# Altium project GBA.PrjPcb (part 3 of 4)

## Sheet [03] - MCU.SchDoc
size A3; DocumentNumber: 5; SheetNumber: 4; SheetTotal: 9
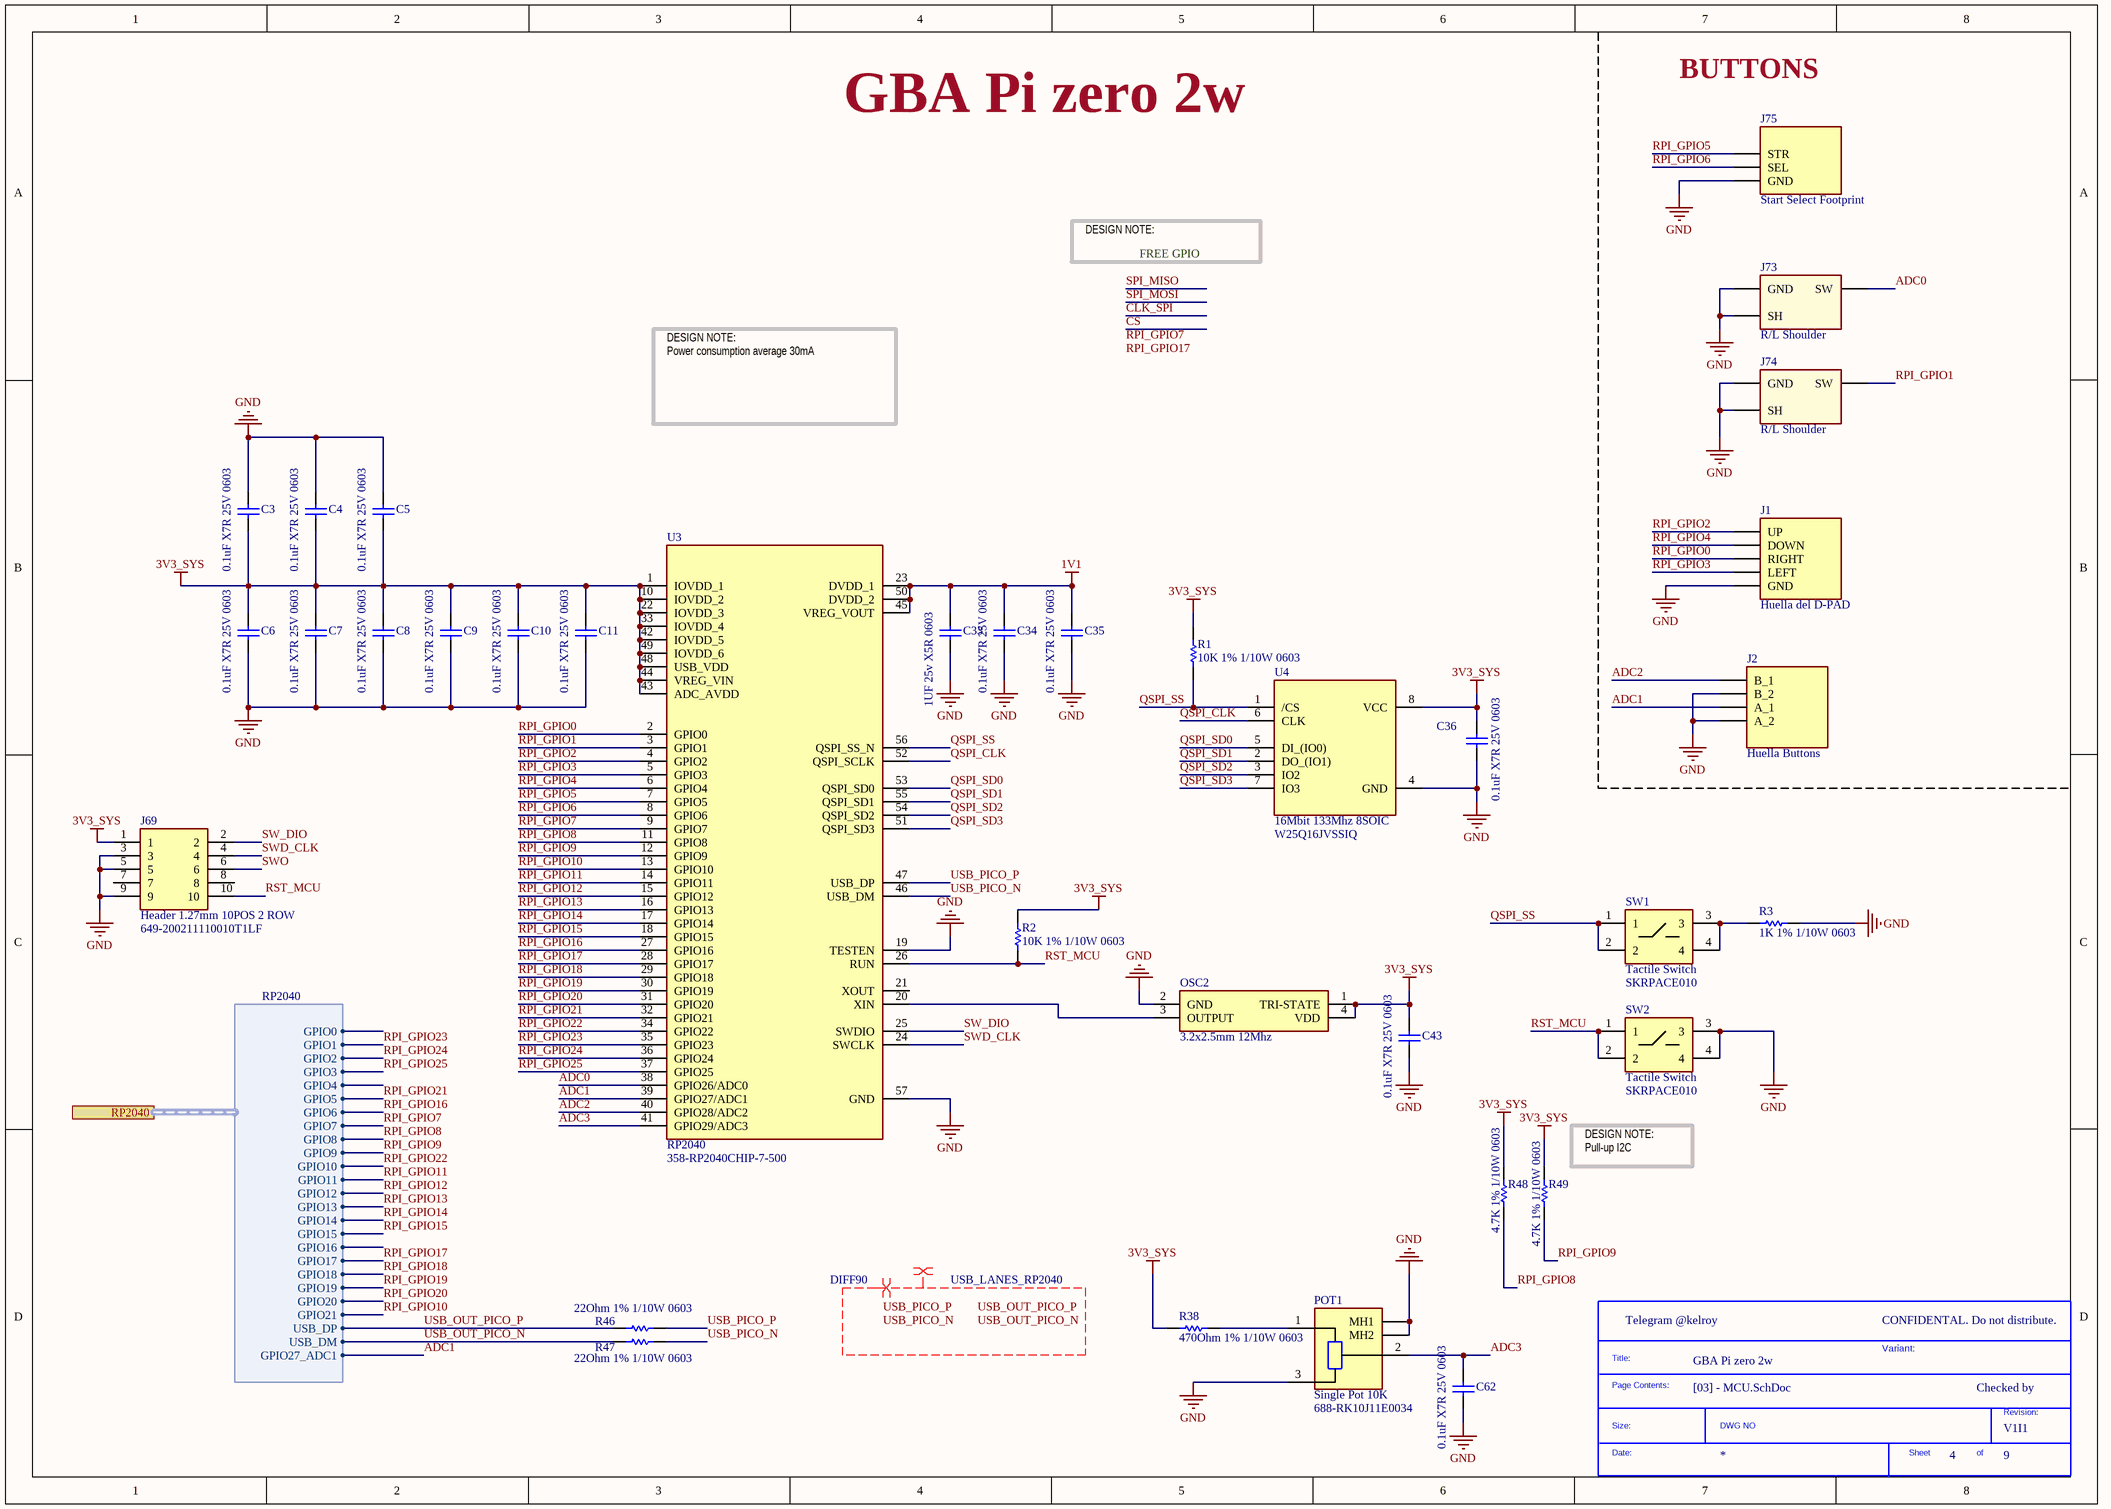
[diagram p7: [03] - MCU.SchDoc]

### Parts
(Parts that share a designator on the sheet are numbered #1, #2 ... from top to bottom, then left to right.)
*#8  SDTitleBlock  (value not drawn)  (graphical)
C3  0.1uF X7R 25V 0603  [C 0603/1608]
C4  0.1uF X7R 25V 0603  [C 0603/1608]
C5  0.1uF X7R 25V 0603  [C 0603/1608]
C6  0.1uF X7R 25V 0603  [C 0603/1608]
C7  0.1uF X7R 25V 0603  [C 0603/1608]
C8  0.1uF X7R 25V 0603  [C 0603/1608]
C9  0.1uF X7R 25V 0603  [C 0603/1608]
C10  0.1uF X7R 25V 0603  [C 0603/1608]
C11  0.1uF X7R 25V 0603  [C 0603/1608]
C33  1UF 25v X5R 0603  [C 0603/1608]
C34  0.1uF X7R 25V 0603  [C 0603/1608]
C35  0.1uF X7R 25V 0603  [C 0603/1608]
C36  0.1uF X7R 25V 0603  [C 0603/1608]
C43  0.1uF X7R 25V 0603  [C 0603/1608]
C62  0.1uF X7R 25V 0603  [C 0603/1608]
J1  Huella del D-PAD  [D-PAD]  (no BOM)
J2  Huella Buttons  [AB_BUTTON]  (no BOM)
J69  Header 1.27mm 10POS 2 ROW  Supplier Part Number 1: 649-200211110010T1LF  [20021111-00010T1LF]
J73  R/L Shoulder  [SHOULDER_BUTTON]
J74  R/L Shoulder  [SHOULDER_BUTTON]
J75  Start Select Footprint  [START SELECT FOOTPRINT]
OSC2  3.2x2.5mm 12Mhz  [ECS3225MV120BNTR]
POT1  Single Pot 10K  Supplier Part Number 1: 688-RK10J11E0034  [RK10J11E0034]
R1  10K 1% 1/10W 0603  [R 0603/1608]
R2  10K 1% 1/10W 0603  [R 0603/1608]
R3  1K 1% 1/10W 0603  [R 0603/1608]
R38  470Ohm 1% 1/10W 0603  [R 0603/1608]
R46  22Ohm 1% 1/10W 0603  [R 0603/1608]
R47  22Ohm 1% 1/10W 0603  [R 0603/1608]
R48  4.7K 1% 1/10W 0603  [R 0603/1608]
R49  4.7K 1% 1/10W 0603  [R 0603/1608]
SW1  Tactile Switch  [SKRPACE010]
SW2  Tactile Switch  [SKRPACE010]
U3  RP2040  Supplier Part Number 1: 358-RP2040CHIP-7-500  [QFN40P700X700X90-57N-D]
U4  16Mbit 133Mhz 8SOIC  [SOIC127P790X216-8N]

### Ports
RP2040 (harness RP2040)

### Harnesses
RP2040: GPIO0, GPIO1, GPIO2, GPIO3, USB_DP, USB_DM, GPIO27_ADC1, GPIO4, GPIO5, GPIO6, GPIO7, GPIO8, GPIO9, GPIO10, GPIO11, GPIO12, GPIO13, GPIO14, GPIO15, GPIO16, GPIO17, GPIO18, GPIO19, GPIO20, GPIO21

### Nets
1V1: C33.1 C34.1 C35.1 U3.23(DVDD_1) U3.45(VREG_VOUT) U3.50(DVDD_2)
3V3_SYS: C3.2 C4.2 C5.2 C6.1 C7.1 C8.1 C9.1 C10.1 C11.1 C36.1 C43.1 J69.1 OSC2.1(TRI-STATE) OSC2.4(VDD) R1.2 R2.2 R38.1 R48.2 R49.2 U3.1(IOVDD_1) U3.10(IOVDD_2) U3.22(IOVDD_3) U3.33(IOVDD_4) U3.42(IOVDD_5) U3.43(ADC_AVDD) U3.44(VREG_VIN) U3.48(USB_VDD) U3.49(IOVDD_6) U4.8(VCC)
GND: C3.1 C4.1 C5.1 C6.2 C7.2 C8.2 C9.2 C10.2 C11.2 C33.2 C34.2 C35.2 C36.2 C43.2 C62.2 J1.GND J2.A_2 J2.B_2 J69.3 J69.5 J69.9 J73.GND J73.SH J74.GND J74.SH J75.GND OSC2.2(GND) POT1.3 POT1.MH1 POT1.MH2 R3.1 SW2.3 SW2.4 U3.19(TESTEN) U3.57(GND) U4.4(GND)  [project net CSN]
ADC0: J73.SW U3.38(GPIO26/ADC0)
ADC1: J2.A_1 U3.39(GPIO27/ADC1) ; port RP2040.GPIO27_ADC1
ADC2: J2.B_1 U3.40(GPIO28/ADC2)
ADC3: C62.1 POT1.2 U3.41(GPIO29/ADC3)
QSPI_CLK: U3.52(QSPI_SCLK) U4.6(CLK)
QSPI_SD0: U3.53(QSPI_SD0) U4.5(DI_(IO0))
QSPI_SD1: U3.55(QSPI_SD1) U4.2(DO_(IO1))
QSPI_SD2: U3.54(QSPI_SD2) U4.3(IO2)
QSPI_SD3: U3.51(QSPI_SD3) U4.7(IO3)
QSPI_SS: R1.1 SW1.1 SW1.2 U3.56(QSPI_SS_N) U4.1(/CS)
RPI_GPIO0: J1.RIGHT U3.2(GPIO0)
RPI_GPIO1: J74.SW U3.3(GPIO1)
RPI_GPIO2: J1.UP U3.4(GPIO2)
RPI_GPIO3: J1.LEFT U3.5(GPIO3)
RPI_GPIO4: J1.DOWN U3.6(GPIO4)
RPI_GPIO5: J75.STR U3.7(GPIO5)
RPI_GPIO6: J75.SEL U3.8(GPIO6)
RPI_GPIO7: U3.9(GPIO7) ; port RP2040.GPIO7
RPI_GPIO8: R48.1 U3.11(GPIO8) ; port RP2040.GPIO8
RPI_GPIO9: R49.1 U3.12(GPIO9) ; port RP2040.GPIO9
RPI_GPIO10: U3.13(GPIO10) ; port RP2040.GPIO21  [project net BTN_PRESS]
RPI_GPIO11: U3.14(GPIO11) ; port RP2040.GPIO11  [project net LED_ST]
RPI_GPIO12: U3.15(GPIO12) ; port RP2040.GPIO12
RPI_GPIO13: U3.16(GPIO13) ; port RP2040.GPIO13
RPI_GPIO14: U3.17(GPIO14) ; port RP2040.GPIO14
RPI_GPIO15: U3.18(GPIO15) ; port RP2040.GPIO15
RPI_GPIO16: U3.27(GPIO16) ; port RP2040.GPIO6  [project net RESET_LCD]
RPI_GPIO17: U3.28(GPIO17) ; port RP2040.GPIO17
RPI_GPIO18: U3.29(GPIO18) ; port RP2040.GPIO18  [project net CTRL_WLED]
RPI_GPIO19: U3.30(GPIO19) ; port RP2040.GPIO19  [project net ON_OFF_RPI]
RPI_GPIO20: U3.31(GPIO20) ; port RP2040.GPIO20
RPI_GPIO21: U3.32(GPIO21) ; port RP2040.GPIO5  [project net GPIO_STH]
RPI_GPIO22: U3.34(GPIO22) ; port RP2040.GPIO10  [project net ENBST]
RPI_GPIO23: U3.35(GPIO23) ; port RP2040.GPIO1  [project net MUTE]
RPI_GPIO24: U3.36(GPIO24) ; port RP2040.GPIO2
RPI_GPIO25: U3.37(GPIO25) ; port RP2040.GPIO3
RST_MCU: J69.10 R2.1 SW2.1 SW2.2 U3.26(RUN)
SW_DIO: J69.2 U3.25(SWDIO)
SWD_CLK: J69.4 U3.24(SWCLK)
SWO: J69.6
USB_OUT_PICO_N: R47.1 ; port RP2040.USB_DM
USB_OUT_PICO_P: R46.1 ; port RP2040.USB_DP
USB_PICO_N: R47.2 U3.46(USB_DM)
USB_PICO_P: R46.2 U3.47(USB_DP)
NetOSC2_3: OSC2.3(OUTPUT) U3.20(XIN)
NetPOT1_1: POT1.1 R38.2
NetR3_2: R3.2 SW1.3 SW1.4

Not connected (* = marked no-connect by the designer): J69 7 8; U3 21(XOUT)

### Layout directives
differential pair; net class DIFF90: USB_OUT_PICO_N, USB_OUT_PICO_P, USB_PICO_N, USB_PICO_P
net class USB_LANES_RP2040; rule Differential Pairs Routing [Pref Gap = 0.18mm    Min Gap  = 0.18mm    Max Gap  = 0.18mmPref Width = 0.15mm    Min Width  = 0.15mm    Max Width  = 0.15mm]: USB_OUT_PICO_N, USB_OUT_PICO_P, USB_PICO_N, USB_PICO_P

### Notes on the sheet
- BUTTONS
- DESIGN NOTE:
- FREE GPIO
- DESIGN NOTE:
  Power consumption average 30mA
- DESIGN NOTE:
  Pull-up I2C
- CONFIDENTAL. Do not distribute.
- Variant:
- Checked by
- Labels drawn without touching a wire or pin: RPI_GPIO7, RPI_GPIO17, USB_OUT_PICO_N, USB_OUT_PICO_P, USB_PICO_N, USB_PICO_P
- (in symbol SDTitleBlock) Title:; Page Contents:; Revision:; Size:; DWG NO; Date:; Sheet; of

### Library data of the parts
C3-C11 C34-C36 C43 C62 = 885012206071: WURTH ELEKTRONIK         885012206071             SMD Multilayer Ceramic Capacitor, 0603 [1608 Metric], 0.1 F, 25 V,  10%, X7R, WCAP-CSGP Series; Manufacturer: Wurth Electronics; Capacitance: 100nF; Supplier 1: Mouser; Manufacturer Part Number: 885012206071; Stock 1: 202580; Pricing 1: 1=0.1, 10=0.046, 50=0.046, 100=0.041, 1000=0.036, 10000=0.036 (USD); Mount: Surface Mount; Case/Package: 0603; Case Code (Metric): 1608; Case Code (Imperial): 0603; Min Operating Temperature: -55°C; Max Operating Temperature: 125°C; Packaging: Cut Tape; Voltage Rating: 25V; Dielectric: X7R; Tolerance: 10%; Voltage Rating (DC): 25V; Length: 0.063inch; Width: 0.031inch; Thickness: 0.037inch; REACH SVHC: Unknown; Supplier Part Number 1: 710-885012206071
C33 = CC0603KRX5R8BB105: CAP CER 1UF 25V X5R 0603; Manufacturer: Yageo; Tolerance: 10%; Supplier 1: Mouser; Manufacturer Part Number: CC0603KRX5R8BB105; RoHS: Yes; Stock 1: 9567246; Pricing 1: 1 = 0,10000, 10 = 0,04700, 50 = 0,04700, 100 = 0,01700, 1000 = 0,01600, 10000 = 0,00800 (USD); Mount: Surface Mount; Case/Package: 0603; Number of Pins: 2; Case Code (Metric): 1608; Case Code (Imperial): 0603; Min Operating Temperature: -55°C; Max Operating Temperature: 85°C; Package Quantity: 1; Capacitance: 1uF; Voltage Rating: 25V; Packaging: Tape and Reel; Dielectric: X5R; Termination: SMD/SMT; Voltage Rating (DC): 25V; Length: 1.6mm; Height: 0.8mm; Width: 0.031inch; Thickness: 0.035inch; Depth: 0.8mm; Radiation Hardening: No; REACH SVHC: No SVHC; Lead Free: Lead Free; Halogen Free: Halogen Free; ComponentLink1URL: https://datasheet.ciiva.com/176/mlccorderingcode-176785.pdf?src-supplier=Digi-Key; ComponentLink1Description: https://datasheet.ciiva.com/176/mlccorderingcode-176785.pdf?src-supplier=Digi-Key; ComponentLink2URL: https://datasheet.ciiva.com/176/mlccorderingcode-176786.pdf?src-supplier=Digi-Key; ComponentLink2Description: https://datasheet.ciiva.com/176/mlccorderingcode-176786.pdf?src-supplier=Digi-Key; ComponentLink3URL: https://datasheet.ciiva.com/176/mlccorderingcode-176787.pdf?src-supplier=Digi-Key; ComponentLink3Description: https://datasheet.ciiva.com/176/mlccorderingcode-176787.pdf?src-supplier=Digi-Key; ComponentLink4URL: https://datasheet.ciiva.com/17436/upy-gphc-x5r-4v-to-50v-12-17436952.pdf?src-supplier=Avnet+Europe; ComponentLink4Description: https://datasheet.ciiva.com/17436/upy-gphc-x5r-4v-to-50v-12-17436952.pdf?src-supplier=Avnet+Europe; ComponentLink5URL: https://datasheet.ciiva.com/7978/1525783-7978171.pdf?src-supplier=Element14; ComponentLink5Description: https://datasheet.ciiva.com/7978/1525783-7978171.pdf?src-supplier=Element14; ComponentLink6URL: https://datasheet.ciiva.com/11586/upy-gphc-x5r-4v-to-50v-12-11586318.pdf?src-supplier=Avnet; ComponentLink6Description: https://datasheet.ciiva.com/11586/upy-gphc-x5r-4v-to-50v-12-11586318.pdf?src-supplier=Avnet; Supplier Part Number 1: 603-CC603KRX5R8BB105
J1 = D_PAD
J2 = BUTTONS
J69 = 20021111-00010T1LF: Conn Unshrouded Header HDR 10 POS 1.27mm Solder ST Thru-Hole Tube; Manufacturer 1: Amphenol FCI; Number of Contacts: 10; Contact Resistance: 30mR; Max Voltage Rating (AC): 125V; Connector Type: Male Pin; Row Spacing: 0.05inch; Contact Post Length: 2.3mm; Supplier 1: Mouser; Manufacturer Part Number 1: 20021111-00010T1LF; Stock 1: 552; Pricing 1: 1=0,62000, 10=0,46900, 100=0,44900, 500=0,39100, 1000=0,32200, 2500=0,29300, 5000=0,28300 (USD); RoHS: Yes; Mount: Through Hole; Contact Plating: Gold; Color: Black; Contact Material: Copper Alloy; Housing Color: Black; Housing Material: Thermoplastic; Min Operating Temperature: -40°C; Max Operating Temperature: 85°C; Number of Rows: 2; Termination: Solder; Package Quantity: 93; Packaging: Rail/Tube; Number of Positions: 10; Orientation: Straight; Length: 6.35mm; Pitch: 1.27mm; Contact Mating Length: 0.12inch; Depth: 3.4mm; ComponentLink1URL: http://www.mouser.com/ds/2/154/minitek127_catalogue-79600.pdf?src-supplier=Mouser; ComponentLink1Description: http://www.mouser.com/ds/2/154/minitek127_catalogue-79600.pdf?src-supplier=Mouser; ComponentLink2URL: http://components.arrow.com/part/dataview/0323_00886572?src-supplier=Arrow+Europe; ComponentLink2Description: http://components.arrow.com/part/dataview/0323_00886572?src-supplier=Arrow+Europe; ComponentLink3URL: http://components.arrow.com/part/dataview/48961252S8521297N8314?src-supplier=Arrow; ComponentLink3Description: http://components.arrow.com/part/dataview/48961252S8521297N8314?src-supplier=Arrow; ComponentLink4URL: http://portal.fciconnect.com/Comergent//fci/drawing/20021111.pdf?src-supplier=Digi-Key; ComponentLink4Description: http://portal.fciconnect.com/Comergent//fci/drawing/20021111.pdf?src-supplier=Digi-Key; ComponentLink5URL: http://portal.fciconnect.com/Comergent/fci/drawing/20021111.pdf?src-supplier=Avnet; ComponentLink5Description: http://portal.fciconnect.com/Comergent/fci/drawing/20021111.pdf?src-supplier=Avnet
J73 J74 = L/R Shoulder: Buy on Aliexpress
J75 = START_SELECT: Start Select
OSC2 = ECS-3225MV-120-BN-TR: Oscillator XO 12MHz ±50ppm 15pF HCMOS 55% 1.8V/2.5V/3.3V 4-Pin Mini-CSMD T/R; Manufacturer: ECS International; Max Supply Current: 4mA; Supplier 1: Mouser; Manufacturer Part Number: ECS-3225MV-120-BN-TR; RoHS: Yes; Category: Oscillators; Stock 1: 3580; Pricing 1: 1=1,21, 10=0,999, 50=0,999, 100=0,883, 1000=0,688, 10000=0,627 (USD); Mount: Surface Mount; Case/Package: SMD/SMT; Min Operating Temperature: -40°C; Max Operating Temperature: 85°C; Packaging: Cut Tape; Frequency: 12MHz; Frequency Stability: 50ppm; Series: ECS-3225MV; ComponentLink1URL: https://www.ecsxtal.com/store/pdf/ECS-3225MV.pdf?src-supplier=Digi-Key; ComponentLink1Description: https://www.ecsxtal.com/store/pdf/ECS-3225MV.pdf?src-supplier=Digi-Key; Supplier Part Number 1: 520-3225MV-120-BNT
POT1 = RK10J11E0034: Res POT 10K Ohm 30% 3/100W 1(Elec)/1(Mech)Turn (14 X 13 X 3.8mm) Pin Thru-Hole; Manufacturer: Alps Electric; Resistance: 10kR; Voltage Rating (AC): 50V; Voltage Rating (DC): 20V; Number of Turns: 1; Supplier 1: Mouser; Manufacturer Part Number: RK10J11E0034; RoHS: Yes; Category: Variable Resistors and Potentiometers; Stock 1: 188; Pricing 1: 1=2,50000, 10=2,20000, 50=2,20000, 100=1,82000, 1000=1,29000, 10000=1,07000 (USD); Mount: Through Hole; Min Operating Temperature: -10°C; Max Operating Temperature: 60°C; Tolerance: 30%; Packaging: Tray; Package Quantity: 10; Taper: Linear; Termination: Pin; Resistor Type: Potentiometer; Type: Potentiometer; Series: RK10J; Length: 14mm; Depth: 13mm; Radiation Hardening: No; Military Standard: Not; RoHS Compliant: Yes; ComponentLink1URL: https://datasheet.ciiva.com/26939/getdatasheetpartid-664944-26939906.pdf?src-supplier=Verical; ComponentLink1Description: https://datasheet.ciiva.com/26939/getdatasheetpartid-664944-26939906.pdf?src-supplier=Verical
R1 R2 = RC0603FR-0710KL: RES SMD 10K OHM 1% 1/10W 0603; Manufacturer: Yageo; Power (Watts): 0.1W, 1/10W; Temperature Coefficient: ±100ppm/°C; Supplier 1: Digi-Key; Manufacturer Part Number: RC0603FR-0710KL; RoHS: RoHS Compliant; Category: Resistors; Stock 1: 47851285; Pricing 1: 1=0.08, 10=0.013, 100=0.005, 1000=0.00224, 2500=0.00195 (EUR); Packaging: Cut Tape (CT); Part Status: Active; Tolerance: ±1%; Composition: Thick Film; Features: Moisture Resistant; Operating Temperature: -55°C ~ 155°C; Package / Case: 0603 (1608 Metric); Supplier Device Package: 0603; Size / Dimension: 0.063" L x 0.032" W (1.60mm x 0.80mm); Height - Seated (Max): 0.022" (0.55mm); Failure Rate: -; ComponentLink1URL: http://www.yageo.com/documents/recent/PYu-RC_Group_51_RoHS_L_8.pdf; ComponentLink1Description: http://www.yageo.com/documents/recent/PYu-RC_Group_51_RoHS_L_8.pdf; Supplier Part Number 1: 311-10.0KHRCT-ND
R3 = RC0603FR-071KL: RES SMD 1K OHM 1% 1/10W 0603; Manufacturer: Yageo; Power (Watts): 0.1W, 1/10W; Temperature Coefficient: ±100ppm/°C; Supplier 1: Digi-Key; Manufacturer Part Number: RC0603FR-071KL; RoHS: RoHS Compliant; Category: Resistors; Stock 1: 8170163; Pricing 1: 1=0.08, 10=0.013, 100=0.005, 1000=0.00224, 2500=0.00195 (EUR); Packaging: Cut Tape (CT); Part Status: Active; Tolerance: ±1%; Composition: Thick Film; Features: Moisture Resistant; Operating Temperature: -55°C ~ 155°C; Package / Case: 0603 (1608 Metric); Supplier Device Package: 0603; Size / Dimension: 0.063" L x 0.032" W (1.60mm x 0.80mm); Height - Seated (Max): 0.022" (0.55mm); Failure Rate: -; ComponentLink1URL: http://www.yageo.com/documents/recent/PYu-RC_Group_51_RoHS_L_8.pdf; ComponentLink1Description: http://www.yageo.com/documents/recent/PYu-RC_Group_51_RoHS_L_8.pdf; Supplier Part Number 1: 311-1.00KHRCT-ND
R38 = RC0603FR-07470RL: RES SMD 470 OHM 1% 1/10W 0603; Manufacturer: Yageo; Power (Watts): 0.1W, 1/10W; Temperature Coefficient: ±100ppm/°C; Supplier 1: Digi-Key; Manufacturer Part Number: RC0603FR-07470RL; RoHS: RoHS Compliant; Category: Resistors; Stock 1: 2343200; Pricing 1: 1=0.08, 10=0.013, 100=0.005, 1000=0.00224, 2500=0.00195 (EUR); Packaging: Cut Tape (CT); Part Status: Active; Tolerance: ±1%; Composition: Thick Film; Features: Moisture Resistant; Operating Temperature: -55°C ~ 155°C; Package / Case: 0603 (1608 Metric); Supplier Device Package: 0603; Size / Dimension: 0.063" L x 0.032" W (1.60mm x 0.80mm); Height - Seated (Max): 0.022" (0.55mm); Failure Rate: -; ComponentLink1URL: http://www.yageo.com/documents/recent/PYu-RC_Group_51_RoHS_L_8.pdf; ComponentLink1Description: http://www.yageo.com/documents/recent/PYu-RC_Group_51_RoHS_L_8.pdf; Supplier Part Number 1: 311-470HRCT-ND
R46 R47 = RC0603FR-0722RL: RES SMD 22 OHM 1% 1/10W 0603; Manufacturer: Yageo; Resistance: 22R; Temperature Coefficient: 100ppm/°C; Voltage Rating (DC): 50V; Power Rating: 100mW; Supplier 1: Mouser; Manufacturer Part Number: RC0603FR-0722RL; RoHS: Yes; Stock 1: 1162810; Pricing 1: 1 = 0,10000, 10 = 0,01800, 50 = 0,01800, 100 = 0,00600, 1000 = 0,00500, 10000 = 0,00300 (USD); Case/Package: 0603; Number of Pins: 2; Case Code (Metric): 1608; Case Code (Imperial): 0603; Min Operating Temperature: -55°C; Max Operating Temperature: 155°C; Tolerance: 1%; Composition: Thick Film; Packaging: Tape and Reel; Voltage Rating: 50V; Package Quantity: 1; Number of Terminations: 2; Termination: SMD/SMT; Military Standard: Not; Max Power Dissipation: 100mW; Features: Moisture Resistant; Length: 1.6mm; Height: 0.022inch; Width: 0.031inch; Depth: 0.8mm; REACH SVHC: No SVHC; Lead Free: Lead Free; ComponentLink1URL: https://datasheet.ciiva.com/11819/0900766b80f96399-11819285.pdf?src-supplier=RSComponents; ComponentLink1Description: https://datasheet.ciiva.com/11819/0900766b80f96399-11819285.pdf?src-supplier=RSComponents; ComponentLink2URL: https://datasheet.ciiva.com/2454/pyu-r-int-thick-7-2454354.pdf?src-supplier=Digi-Key; ComponentLink2Description: https://datasheet.ciiva.com/2454/pyu-r-int-thick-7-2454354.pdf?src-supplier=Digi-Key; ComponentLink3URL: https://datasheet.ciiva.com/2454/pyu-r-int-thick-7-2454355.pdf?src-supplier=Digi-Key; ComponentLink3Description: https://datasheet.ciiva.com/2454/pyu-r-int-thick-7-2454355.pdf?src-supplier=Digi-Key; ComponentLink4URL: https://datasheet.ciiva.com/2454/pyu-r-int-thick-7-2454356.pdf?src-supplier=Digi-Key; ComponentLink4Description: https://datasheet.ciiva.com/2454/pyu-r-int-thick-7-2454356.pdf?src-supplier=Digi-Key; ComponentLink5URL: https://datasheet.ciiva.com/46440/1868787-46440901.pdf?src-supplier=Element14; ComponentLink5Description: https://datasheet.ciiva.com/46440/1868787-46440901.pdf?src-supplier=Element14; ComponentLink6URL: https://datasheet.ciiva.com/46395/443971-46395032.pdf?src-supplier=Element14; ComponentLink6Description: https://datasheet.ciiva.com/46395/443971-46395032.pdf?src-supplier=Element14; Supplier Part Number 1: 603-RC0603FR-0722RL
R48 R49 = RC0603FR-074K7L: RES SMD 4.7K OHM 1% 1/10W 0603; Manufacturer: Yageo; Resistance: 4.7kR; Temperature Coefficient: 100ppm/°C; Power Rating: 100mW; Voltage Rating (DC): 50V; Supplier 1: Mouser; Manufacturer Part Number: RC0603FR-074K7L; RoHS: Yes; Stock 1: 3735049; Pricing 1: 1 = 0,10000, 10 = 0,01800, 50 = 0,01800, 100 = 0,00600, 1000 = 0,00500, 10000 = 0,00300 (USD); Case/Package: 0603; Number of Pins: 2; Case Code (Imperial): 0603; Case Code (Metric): 1608; Min Operating Temperature: -55°C; Max Operating Temperature: 155°C; Tolerance: 1%; Composition: Thick Film; Packaging: Tape and Reel; Voltage Rating: 50V; Termination: SMD/SMT; Military Standard: Not; Length: 1.6mm; Height: 0.45mm; Width: 0.8mm; Depth: 0.8mm; Lead Pitch: 0.3mm; REACH SVHC: No SVHC; Lead Free: Lead Free; ComponentLink1URL: https://datasheet.ciiva.com/15189/getdatasheetpartid-422754-15189760.pdf?src-supplier=Verical; ComponentLink1Description: https://datasheet.ciiva.com/15189/getdatasheetpartid-422754-15189760.pdf?src-supplier=Verical; ComponentLink2URL: https://datasheet.ciiva.com/22747/443971-22747528.pdf?src-supplier=Element14; ComponentLink2Description: https://datasheet.ciiva.com/22747/443971-22747528.pdf?src-supplier=Element14; ComponentLink3URL: https://datasheet.ciiva.com/7660/38590-7660794.pdf?src-supplier=Element14; ComponentLink3Description: https://datasheet.ciiva.com/7660/38590-7660794.pdf?src-supplier=Element14; ComponentLink4URL: https://datasheet.ciiva.com/7746/1868787-7746365.pdf?src-supplier=Element14; ComponentLink4Description: https://datasheet.ciiva.com/7746/1868787-7746365.pdf?src-supplier=Element14; ComponentLink5URL: https://datasheet.ciiva.com/46440/1868787-46440909.pdf?src-supplier=Element14; ComponentLink5Description: https://datasheet.ciiva.com/46440/1868787-46440909.pdf?src-supplier=Element14; ComponentLink6URL: https://datasheet.ciiva.com/7746/1738695-7746366.pdf?src-supplier=Element14; ComponentLink6Description: https://datasheet.ciiva.com/7746/1738695-7746366.pdf?src-supplier=Element14; Supplier Part Number 1: 603-RC0603FR-074K7L
SW1 SW2 = SKRPACE010: Tactile Switches 4.2x3.2x2.5mm 260gf; Manufacturer: Alps Electric; Operating Force: 2.55N; Throw Configuration: SPST; Max Voltage Rating (DC): 16V; Max Current Rating: 50mA; Electrical Life: 50000Cycles; Contact Resistance: 500mR; Actuator Length: 0.7mm; Supplier 1: Avnet; Manufacturer Part Number: SKRPACE010; RoHS: Yes; Category: Tactile Switches; Pricing 1: 4000=0,05263, 8000=0,05195, 16000=0,05063, 24000=0,04938, 40000=0,04819 (USD); Mount: Surface Mount; Case/Package: SMD/SMT; Color: Clear; Contact Plating: Silver; Min Operating Temperature: -20°C; Max Operating Temperature: 70°C; Termination: J-Bend; Packaging: Tape and Reel; Orientation: Straight; Current Rating: 50mA; Voltage Rating (DC): 16V; Package Quantity: 4000; Length: 4.6mm; Depth: 3.2mm; Radiation Hardening: No; Lead Free: Lead Free; ComponentLink1URL: https://datasheet.ciiva.com/16156/skrp-16156208.pdf?src-supplier=Onlinecomponents.com; ComponentLink1Description: https://datasheet.ciiva.com/16156/skrp-16156208.pdf?src-supplier=Onlinecomponents.com; ComponentLink2URL: https://datasheet.ciiva.com/18145/getdatasheetpartid-652528-18145947.pdf?src-supplier=Verical; ComponentLink2Description: https://datasheet.ciiva.com/18145/getdatasheetpartid-652528-18145947.pdf?src-supplier=Verical; Supplier Part Number 1: SKRPACE010
U3 = RPICHIPRP2040-7-500: RP2040 Raspberry pi Dual core M0; Supplier 1: Mouser; Manufacturer: Raspberry Pi; Manufacturer Part Number: RPICHIPRP2040-7-500; RoHS: No; Category: Uncategorized; Stock 1: 12140; Pricing 1: 1=1,25000, 10=1,25000, 50=1,25000, 100=1,25000, 1000=1,25000, 10000=1,25000 (USD)
U4 = W25Q16JVSSIQ: ICFLASH16MBIT133MHZ8SOIC; Manufacturer: Winbond; Memory Type: Non-Volatile,FLASH; Memory Size: 16Mb; Supplier 1: Arrow Electronics; Manufacturer Part Number: W25Q16JVSSIQ; RoHS: Yes; Category: Flash; Stock 1: 7759; Pricing 1: 1=0,65330, 10=0,63190, 25=0,59860, 50=0,59510, 100=0,52980, 250=0,52330, 500=0,51540, 1000=0,50070, 5000=0,44520 (USD); Mount: Surface Mount; Case/Package: SOIC; Min Operating Temperature: -40°C; Max Operating Temperature: 85°C; Packaging: Rail/Tube; Frequency: 133MHz; RoHS Compliant: Yes; ComponentLink1URL: http://www.winbond.com/resource-files/w25q16jv%20spi%20revg%2003222018%20plus.pdf?src-supplier=Digi-Key; ComponentLink1Description: http://www.winbond.com/resource-files/w25q16jv%20spi%20revg%2003222018%20plus.pdf?src-supplier=Digi-Key; Supplier Part Number 1: W25Q16JVSSIQ